# EasyEDA Pro project easyeda-2024-project.epro

# Schematic Schematic1
Create Date: 2024-07-01; Page Name: P1; Project Name: 风压式电脑散热器_2024-07-01_22-35-42; Schematic Name: Schematic1; Update Date: 2024-07-15; Company: 嘉立创EDA; Page Size: A4; Version: V1.0
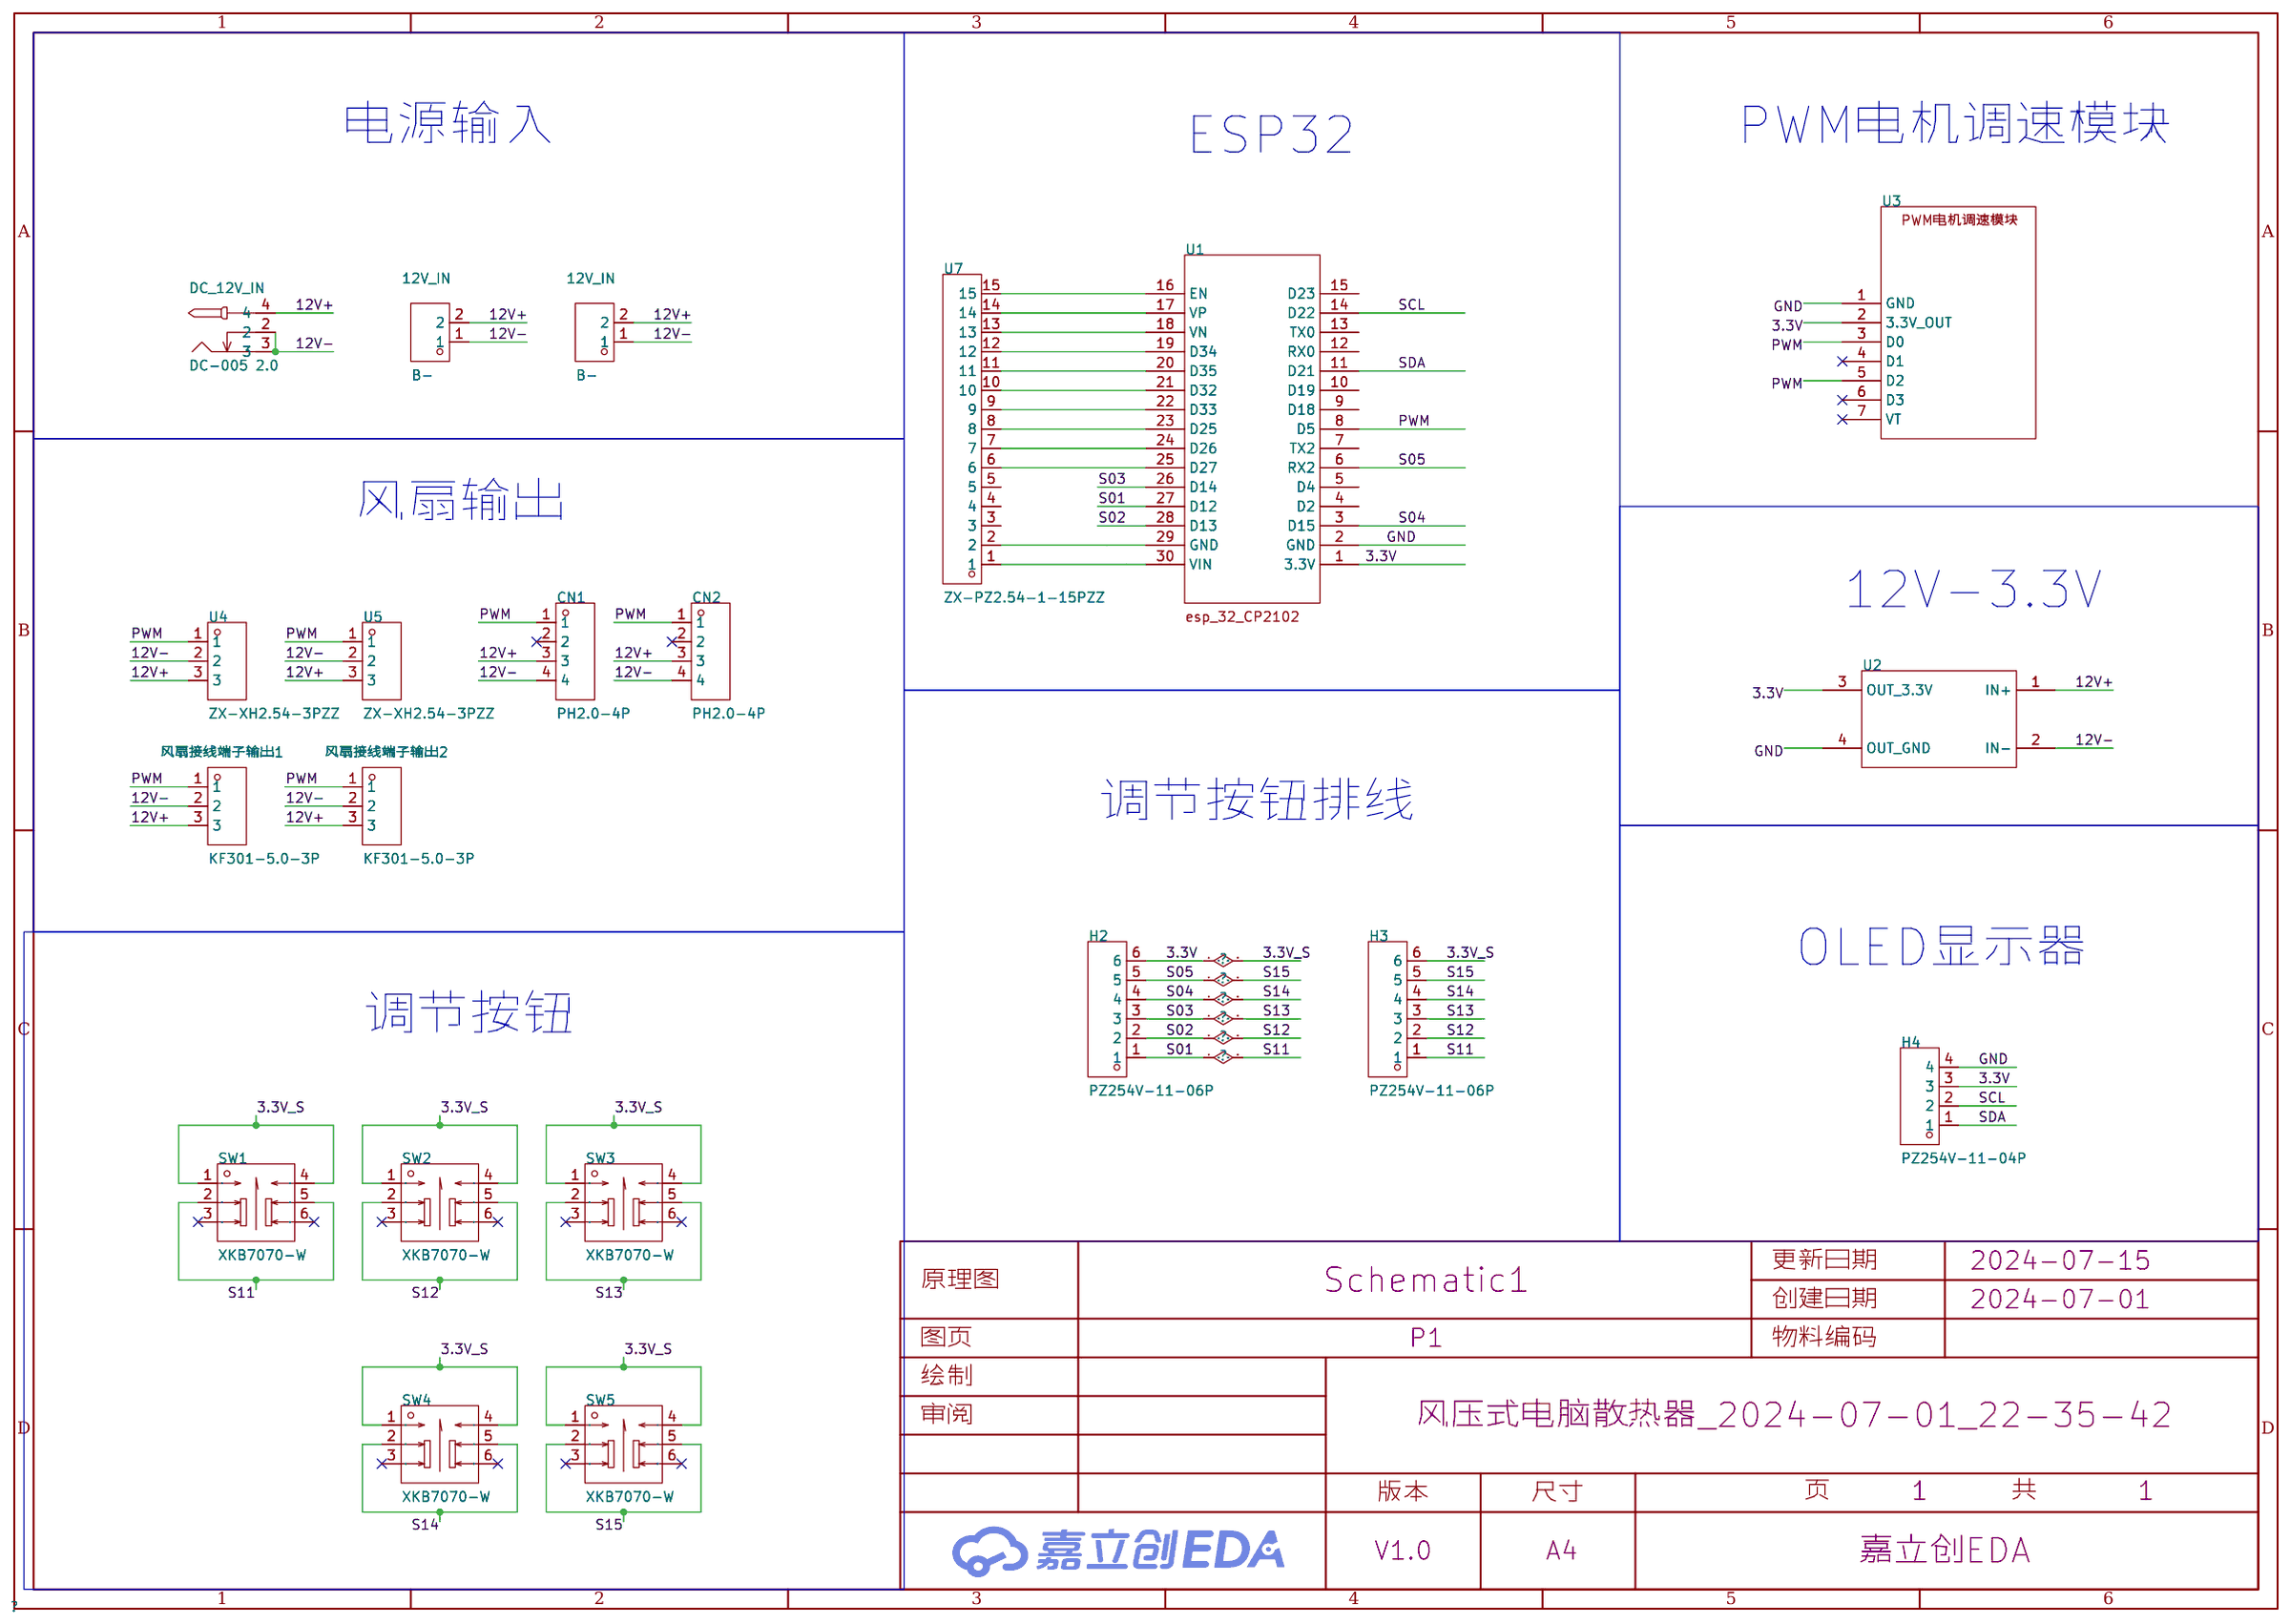
[diagram p0: schematic sheet]

## Parts
12V_IN  B-  [CONN-TH_P5.00_KF301-5.0-2P]
12V_IN#2  B-  [CONN-TH_P5.00_KF301-5.0-2P]
CN1  PH2.0-4P  [CONN-TH_PH2.0-4P]
CN2  PH2.0-4P  [CONN-TH_PH2.0-4P]
DC_12V_IN  DC-005 2.0  [DC-IN-TH_DC-5520-1]
H2  PZ254V-11-06P  [HDR-TH_6P-P2.54-V-M]
H3  PZ254V-11-06P  [HDR-TH_6P-P2.54-V-M]
H4  PZ254V-11-04P  [HDR-TH_4P-P2.54-V-M]
SW1  XKB7070-W  [SW-TH_6P-L7.2-W7.2-P2.00-LS5.0]
SW2  XKB7070-W  [SW-TH_6P-L7.2-W7.2-P2.00-LS5.0]
SW3  XKB7070-W  [SW-TH_6P-L7.2-W7.2-P2.00-LS5.0]
SW4  XKB7070-W  [SW-TH_6P-L7.2-W7.2-P2.00-LS5.0]
SW5  XKB7070-W  [SW-TH_6P-L7.2-W7.2-P2.00-LS5.0]
U1  -  [ESP32]
U2  -  [DC_3.3v]
U3  -  [PWM电机调速模块]
U4  ZX-XH2.54-3PZZ  [CONN-TH_3P-P2.54_2501S-3P]
U5  ZX-XH2.54-3PZZ  [CONN-TH_3P-P2.54_2501S-3P]
U7  ZX-PZ2.54-1-15PZZ  [HDR-TH_15P-P2.54-V-M]
风扇接线端子输出1  KF301-5.0-3P  [CONN-TH_3P-P5.00_KF301-5.0-3P]
风扇接线端子输出2  KF301-5.0-3P  [CONN-TH_3P-P5.00_KF301-5.0-3P]

## Library data of the parts
12V_IN 12V_IN#2 = KF301-5.0-2P: 间距:5mm;结构:1x2P;排数:1;每排PIN数:2;安装方式:直插;额定电流:17A;额定电压:250V;线规 - AWG:14~22;线规 - mm2:1.5;工作温度范围:-30℃~+120℃;颜色:蓝色;; LCSC Part Name: 5mm 1x2P 排数:1 每排P数:2 直插 可拼接 铜 环保; Supplier Part: C474881; Manufacturer: KEFA(科发); Supplier Footprint: 插件,P=5mm; JLCPCB Part Class: 扩展库; Datasheet: https://atta.szlcsc.com/upload/public/pdf/source/20230317/03A5B5FC229D6F9225E8F51DA1A4E80A.pdf; Supplier: LCSC; Pitch: 5mm; Structure: 1x2P; Number of Rows: 1; Number of PINs Per Row: 2; Mounting Style: 直插; Current Rating (Max): 17A; Voltage Rating (Max): 250V; Wire Gauge - AWG: 14~22; Wire Gauge - mm2: 1.5; Operating Temperature Range: -30℃~+120℃; Color: 蓝色; Number of Pins: 2P
CN1 CN2 = PH2.0-4P_C722763: 插针结构:1x4P;间距:2mm;安装方式:直插;参考系列:-;总PIN数:4P;排数:1;每排PIN数:4;行距:-;额定电流:5A;工作温度范围:-25℃~+85℃;; LCSC Part Name: 1x4P 间距:2mm 直插; Supplier Part: C722763; Manufacturer: CAX(创都); Supplier Footprint: 插件,P=2mm; JLCPCB Part Class: 扩展库; Datasheet: https://atta.szlcsc.com/upload/public/pdf/source/20200831/C722752_2CEED1D72592B01C53DF3269E60027F0.pdf; Supplier: LCSC; Pins Structure: 1x4P; Pitch: 2mm; Mounting Style: 直插; Number of Pins: 4P; Number of Rows: 1; Number of PINs Per Row: 4; Current Rating (Max): 5A; Operating Temperature Range: -25℃~+85℃
DC_12V_IN = DC-005 2.0: 连接器类型:DC电源插座;安装方式:弯插;触点内径:2mm;触点外径:6.4mm;额定电流:-;额定电压:-;工作温度范围:-;; LCSC Part Name: DC电源插座 内径:2mm 外径:6.4mm 铁材质; Supplier Part: C16214; Manufacturer: BOOMELE(博穆精密); Supplier Footprint: 插件; JLCPCB Part Class: 扩展库; Datasheet: https://atta.szlcsc.com/upload/public/pdf/source/20190827/C16214_DA59F99E888FED58D9833F5341D610B0.pdf; Supplier: LCSC; Connector Type: DC电源插座; Mounting Style: 弯插; Inside Contact Diameter: 2mm; Outside Contact Diameter: 6.4mm
H2 H3 = PZ254V-11-06P: 插针结构:1x6P;间距:2.54mm;行距:-;圆针/方针:方针;安装类型:直插;排数:单排;总PIN位数:6P;额定电流:-;额定电压:-;配合针长度:6mm;塑高:2.5mm;端接针长度:3mm;触头材质:黄铜;触头镀层:-;工作温度范围:-40℃~+105℃;颜色:黑色;; LCSC Part Name: 间距:2.54mm 1x6P 直插 方针; Supplier Part: C492405; Manufacturer: XFCN(兴飞); Supplier Footprint: 插件,P=2.54mm; JLCPCB Part Class: 扩展库; Datasheet: https://atta.szlcsc.com/upload/public/pdf/source/20200309/C492405_597F1930F5B55CC3C7FD95458F1C3977.pdf; Supplier: LCSC; Pin Structure: 1x6P; Pitch: 2.54mm; Circluar Pins/Square Pins: 方针; Mounting Type: 直插; Number of Rows: 单排; Number of Pins: 6P; Length of Mating Pin: 6mm; Insulation Height: 2.5mm; Length of End Connection Pin: 3mm; Contact Material: 黄铜; Operating Temperature Range: -40℃~+105℃; Color: 黑色
H4 = PZ254V-11-04P_C492403: 插针结构:1x4P;间距:2.54mm;行距:-;圆针/方针:方针;安装类型:直插;排数:单排;总PIN位数:4P;额定电流:-;额定电压:-;配合针长度:6mm;塑高:2.5mm;端接针长度:3mm;触头材质:黄铜;触头镀层:-;工作温度范围:-40℃~+105℃;颜色:黑色;; LCSC Part Name: 间距:2.54mm 1x4P 直插 方针; Supplier Part: C492403; Manufacturer: XFCN(兴飞); Supplier Footprint: 插件,P=2.54mm; JLCPCB Part Class: 扩展库; Datasheet: https://atta.szlcsc.com/upload/public/pdf/source/20200309/C492403_F9F19131791D08044AD4F84F8E751A34.pdf; Supplier: LCSC; Pin Structure: 1x4P; Pitch: 2.54mm; Circluar Pins/Square Pins: 方针; Mounting Type: 直插; Number of Rows: 单排; Number of Pins: 4P; Length of Mating Pin: 6mm; Insulation Height: 2.5mm; Length of End Connection Pin: 3mm; Contact Material: 黄铜; Operating Temperature Range: -40℃~+105℃; Color: 黑色
SW1-SW5 = XKB7070-W: 电路结构:-;自锁/无锁:无锁;安装方式:直插;触点电流:100mA;额定电压 (AC):250V;额定电压 (DC):30V;带灯:不带;作用力:160gf;机械寿命:1万次;; LCSC Part Name: 按键开关   7*7插件无锁 蓝白黑; Supplier Part: C318864; Manufacturer: XKB Connectivity(中国星坤); Supplier Footprint: 插件; JLCPCB Part Class: 扩展库; Datasheet: https://atta.szlcsc.com/upload/public/pdf/source/20211015/75A682A27A424BDE8D93C2CFA14C38FE.pdf; Supplier: LCSC; Self Lock / No Lock: 无锁; Actuator Style: 矩形按钮; Mounting Style: 直插; Contact Current: 100mA; Voltage Rating (AC): 250V; Voltage Rating (DC): 30V; Insulation Resistance: 100MΩ; Actuator/Cap Color: 蓝色; With Lamp: 不带; Pin Style: PC引脚; Operating Force: 160gf; Operating Temperature: -15℃~+55℃; Mechanical Life: 1万次
U1 = ESP-32
U2 = DC_3.3v
U3 = PWM电机调速模块
U4 U5 = ZX-XH2.54-3PZZ: 插针结构:1x3P;间距:2.54mm;安装方式:直插;参考系列:XH;总PIN数:3P;排数:1;每排PIN数:3;行距:-;额定电流:3A;触头材质:黄铜;触头镀层:锡;工作温度范围:-25℃~+85℃;; Supplier Part: C7429633; Manufacturer: Megastar(兆星); Supplier Footprint: 插件,P=2.54mm; JLCPCB Part Class: 扩展库; Datasheet: https://atta.szlcsc.com/upload/public/pdf/source/20230619/AE17037A2CFDBE8D9CBA775D61AD0A84.pdf; Supplier: LCSC; Pins Structure: 1x3P; Pitch: 2.54mm; Mounting Style: 直插; Reference Series: XH; Number of Pins: 3P; Number of Rows: 1; Number of PINs Per Row: 3; Current Rating (Max): 3A; Contact Material: 黄铜; Contact Plating: 锡; Operating Temperature Range: -25℃~+85℃
U7 = ZX-PZ2.54-1-15PZZ: 插针结构:1x15P;间距:2.54mm;行距:-;圆针/方针:方针;安装类型:直插;排数:单排;总PIN位数:15P;额定电流:3A;额定电压:1kV;配合针长度:6mm;塑高:2.5mm;端接针长度:3mm;触头材质:黄铜;触头镀层:金;工作温度范围:-40℃~+105℃;焊接温度(最大值):-;颜色:黑色;; LCSC Part Name: 1x15P 间距:2.54mm 方针 直插; Supplier Part: C7501269; Manufacturer: Megastar(兆星); Supplier Footprint: 插件,P=2.54mm; JLCPCB Part Class: Extended Part; Datasheet: https://atta.szlcsc.com/upload/public/pdf/source/20231122/A1A587BCB61FD4E661A7B23F28C6B7B8.pdf; Supplier: LCSC; Pin Structure: 1x15P; Pitch: 2.54mm; Circluar Pins/Square Pins: 方针; Mounting Type: 直插; Number of Rows: 单排; Number of Pins: 15P; Current Rating (Max): 3A; Voltage Rating (Max): 1kV; Length of Mating Pin: 6mm; Insulation Height: 2.5mm; Length of End Connection Pin: 3mm; Contact Material: 黄铜; Contact Plating: 金; Operating Temperature Range: -40℃~+105℃; Color: 黑色
风扇接线端子输出1 风扇接线端子输出2 = KF301-5.0-3P: 结构:1x3P;间距:5mm;颜色:蓝色;安装方式:直插;额定电流:17A;额定电压:250V;排数:1;线规 - AWG:14~22;线规 - 平方毫米:1.5;每排PIN数:3;工作温度范围:-30℃~+120℃;; LCSC Part Name: 5mm 1x3P 排数:1 每排P数:3 直插; Supplier Part: C474882; Manufacturer: KEFA(科发); Supplier Footprint: 插件,P=5mm; JLCPCB Part Class: 扩展库; Datasheet: https://atta.szlcsc.com/upload/public/pdf/source/20230317/03A5B5FC229D6F9225E8F51DA1A4E80A.pdf; Supplier: LCSC; Structure: 1x3P; Pitch: 5mm; Color: 蓝色; Mounting Style: 直插; Current Rating (Max): 17A; Voltage Rating (Max): 250V; Number of Pins: 3P; Number of Rows: 1; Wire Gauge - AWG: 14~22; Wire Gauge - mm2: 1.5; Number of PINs Per Row: 3; Operating Temperature Range: -30℃~+120℃

## Nets
3.3V: H2.6 H3.6 H4.3 SW1.1 SW1.4 SW2.1 SW2.4 SW3.1 SW3.4 SW4.1 SW4.4 SW5.1 SW5.4 U1.1(3.3V) U2.3(OUT_3.3V) U3.2(3.3V_OUT)
12V+: 12V_IN.2 12V_IN#2.2 CN1.3 CN2.3 DC_12V_IN.4 U2.1(IN+) U4.3 U5.3 风扇接线端子输出1.3 风扇接线端子输出2.3
12V-: 12V_IN.1 12V_IN#2.1 CN1.4 CN2.4 DC_12V_IN.2 DC_12V_IN.3 U2.2(IN-) U4.2 U5.2 风扇接线端子输出1.2 风扇接线端子输出2.2
GND: H4.4 U1.2(GND) U2.4(OUT_GND) U3.1(GND)
PWM: CN1.1 CN2.1 U1.8(D5) U3.3(D0) U3.5(D2) U4.1 U5.1 风扇接线端子输出1.1 风扇接线端子输出2.1
S01: H2.1 H3.1 SW1.2 SW1.5 U1.27(D12)
S02: H2.2 H3.2 SW2.2 SW2.5 U1.28(D13)
S03: H2.3 H3.3 SW3.2 SW3.5 U1.26(D14)
S04: H2.4 H3.4 SW4.2 SW4.5 U1.3(D15)
S05: H2.5 H3.5 SW5.2 SW5.5 U1.6(RX2)
SCL: H4.2 U1.14(D22)
SDA: H4.1 U1.11(D21)
$1N6643: U1.16(EN) U7.15
$1N6657: U1.17(VP) U7.14
$1N6660: U1.18(VN) U7.13
$1N6663: U1.19(D34) U7.12
$1N6666: U1.20(D35) U7.11
$1N6669: U1.21(D32) U7.10
$1N6672: U1.22(D33) U7.9
$1N6675: U1.23(D25) U7.8
$1N6678: U1.24(D26) U7.7
$1N6681: U1.25(D27) U7.6
$1N6684: U1.30(VIN) U7.1
$1N6687: U1.29(GND) U7.2

Not connected (* = marked no-connect by the designer): CN1 2*; CN2 2*; SW1 3* 6*; SW2 3* 6*; SW3 3* 6*; SW4 3* 6*; SW5 3* 6*; U1 4(D2) 5(D4) 7(TX2) 9(D18) 10(D19) 12(RX0) 13(TX0) 15(D23); U3 4(D1)* 6(D3)* 7(VT)*; U7 3 4 5

## Notes on the sheet
- 电源输入
- ESP32
- PWM电机调速模块
- 风扇输出
- 12V-3.3V
- 调节按钮排线
- OLED显示器
- 调节按钮

# Board PCB1
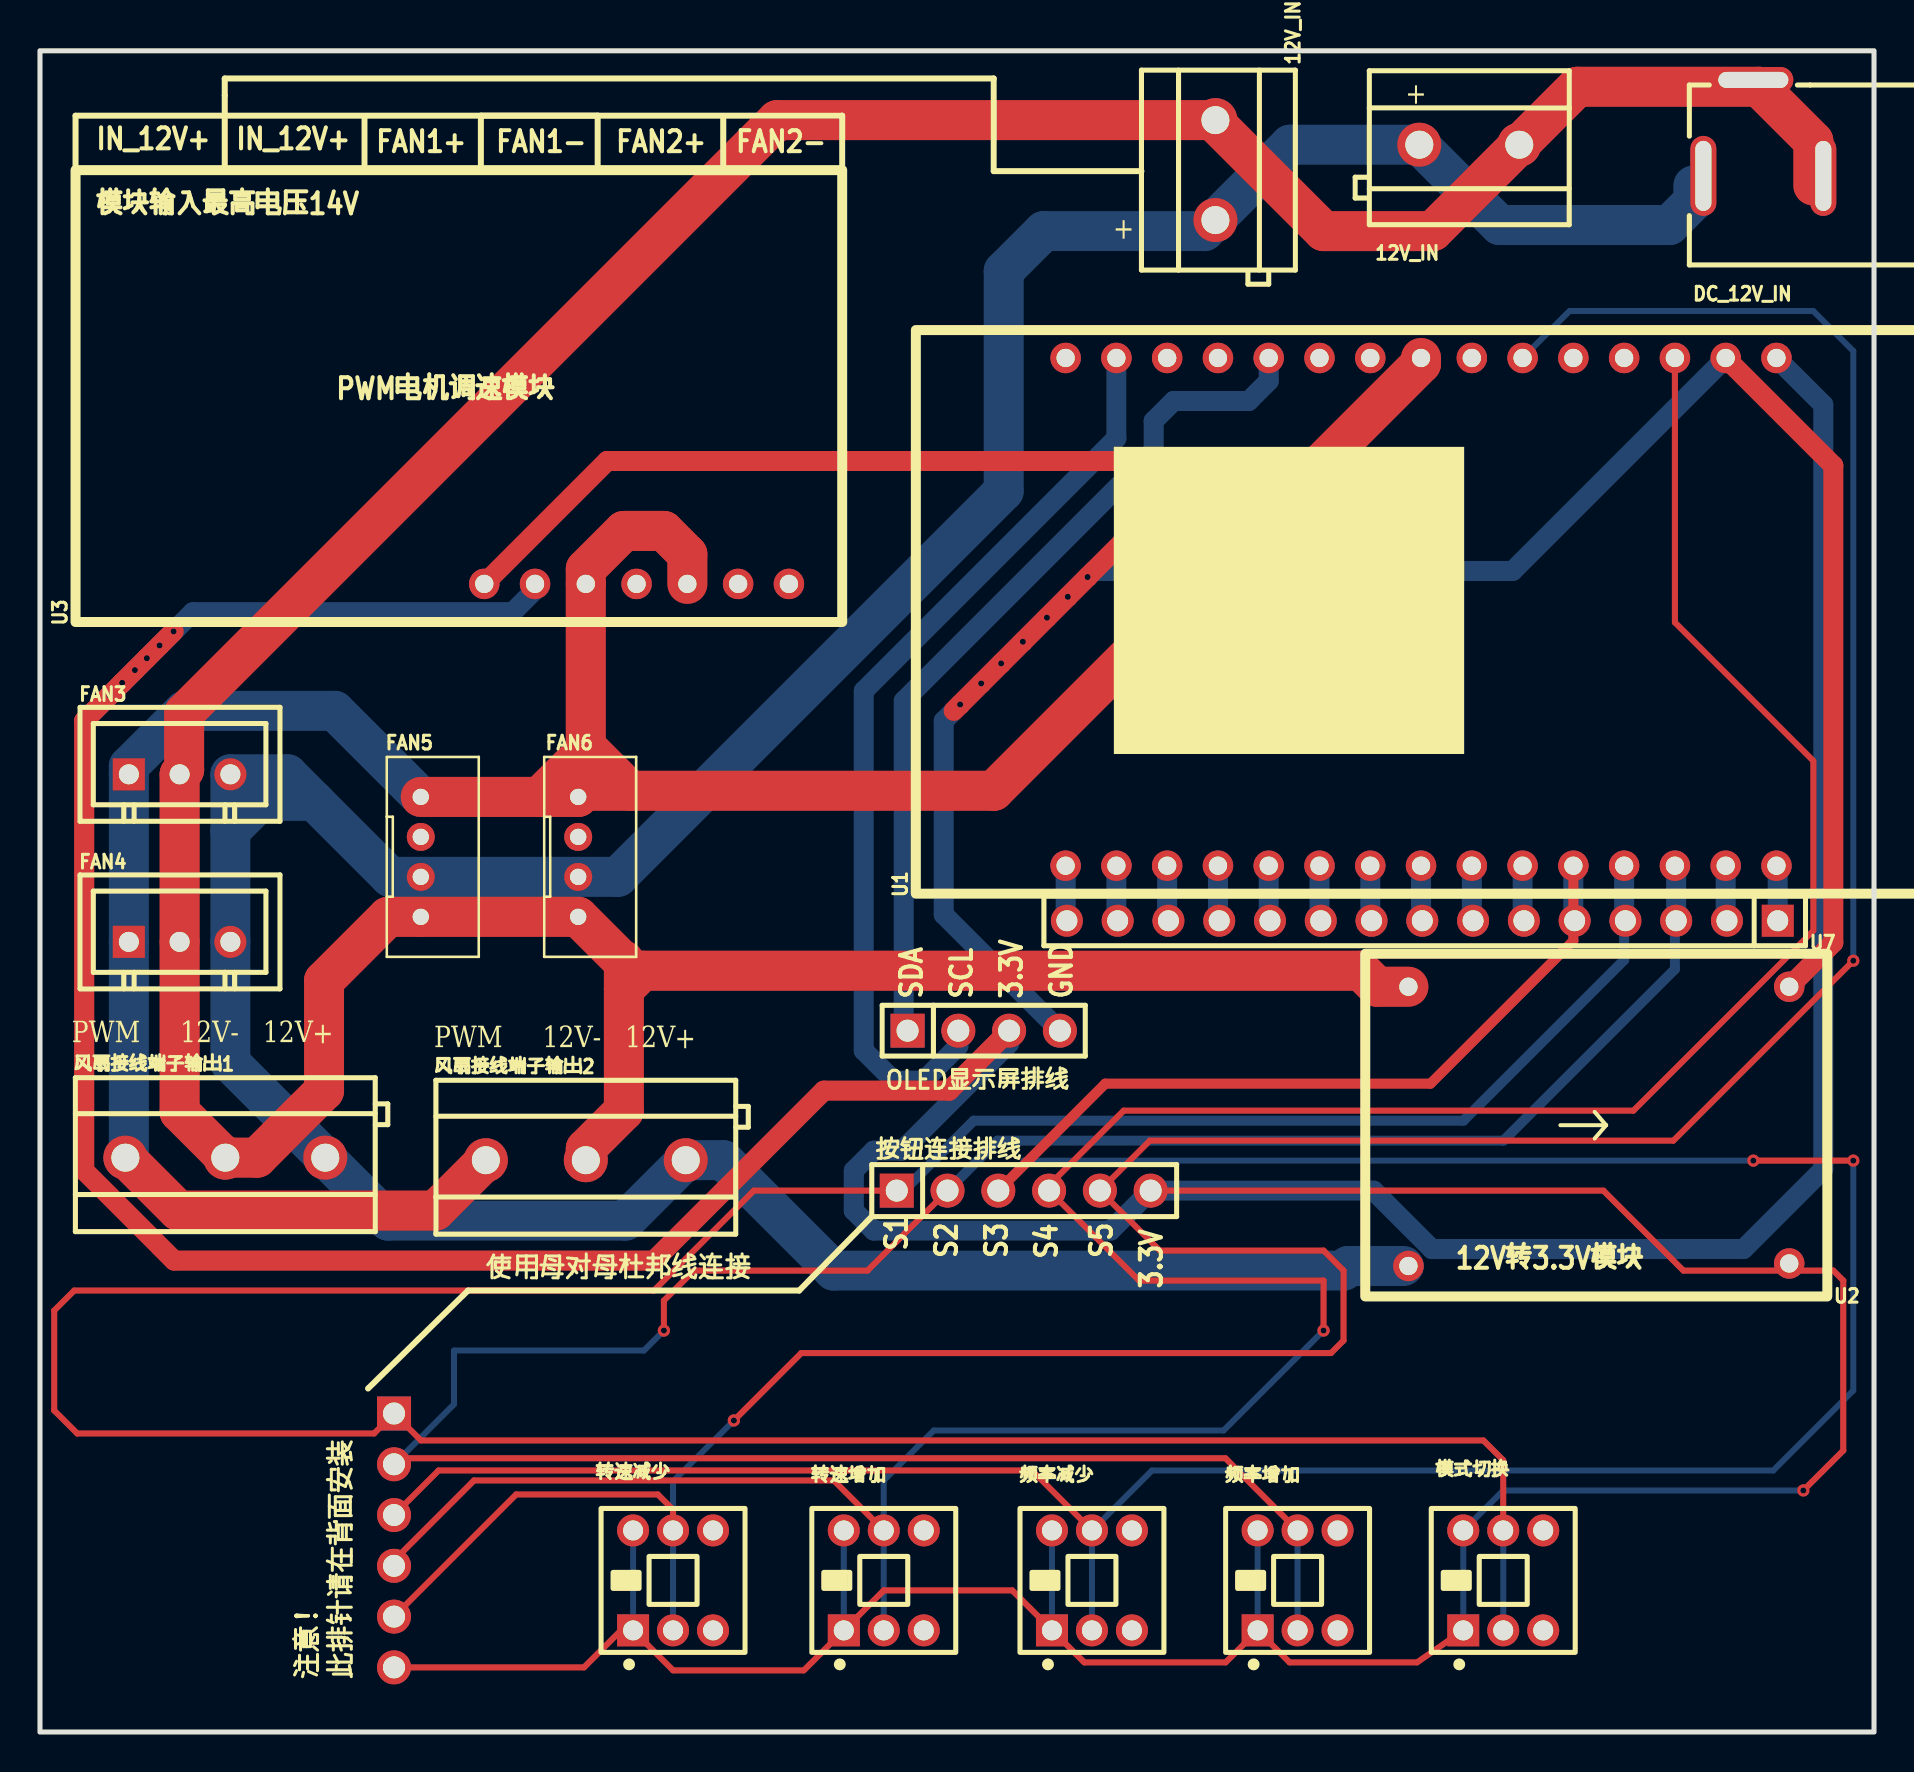
[diagram p1: board, top side]
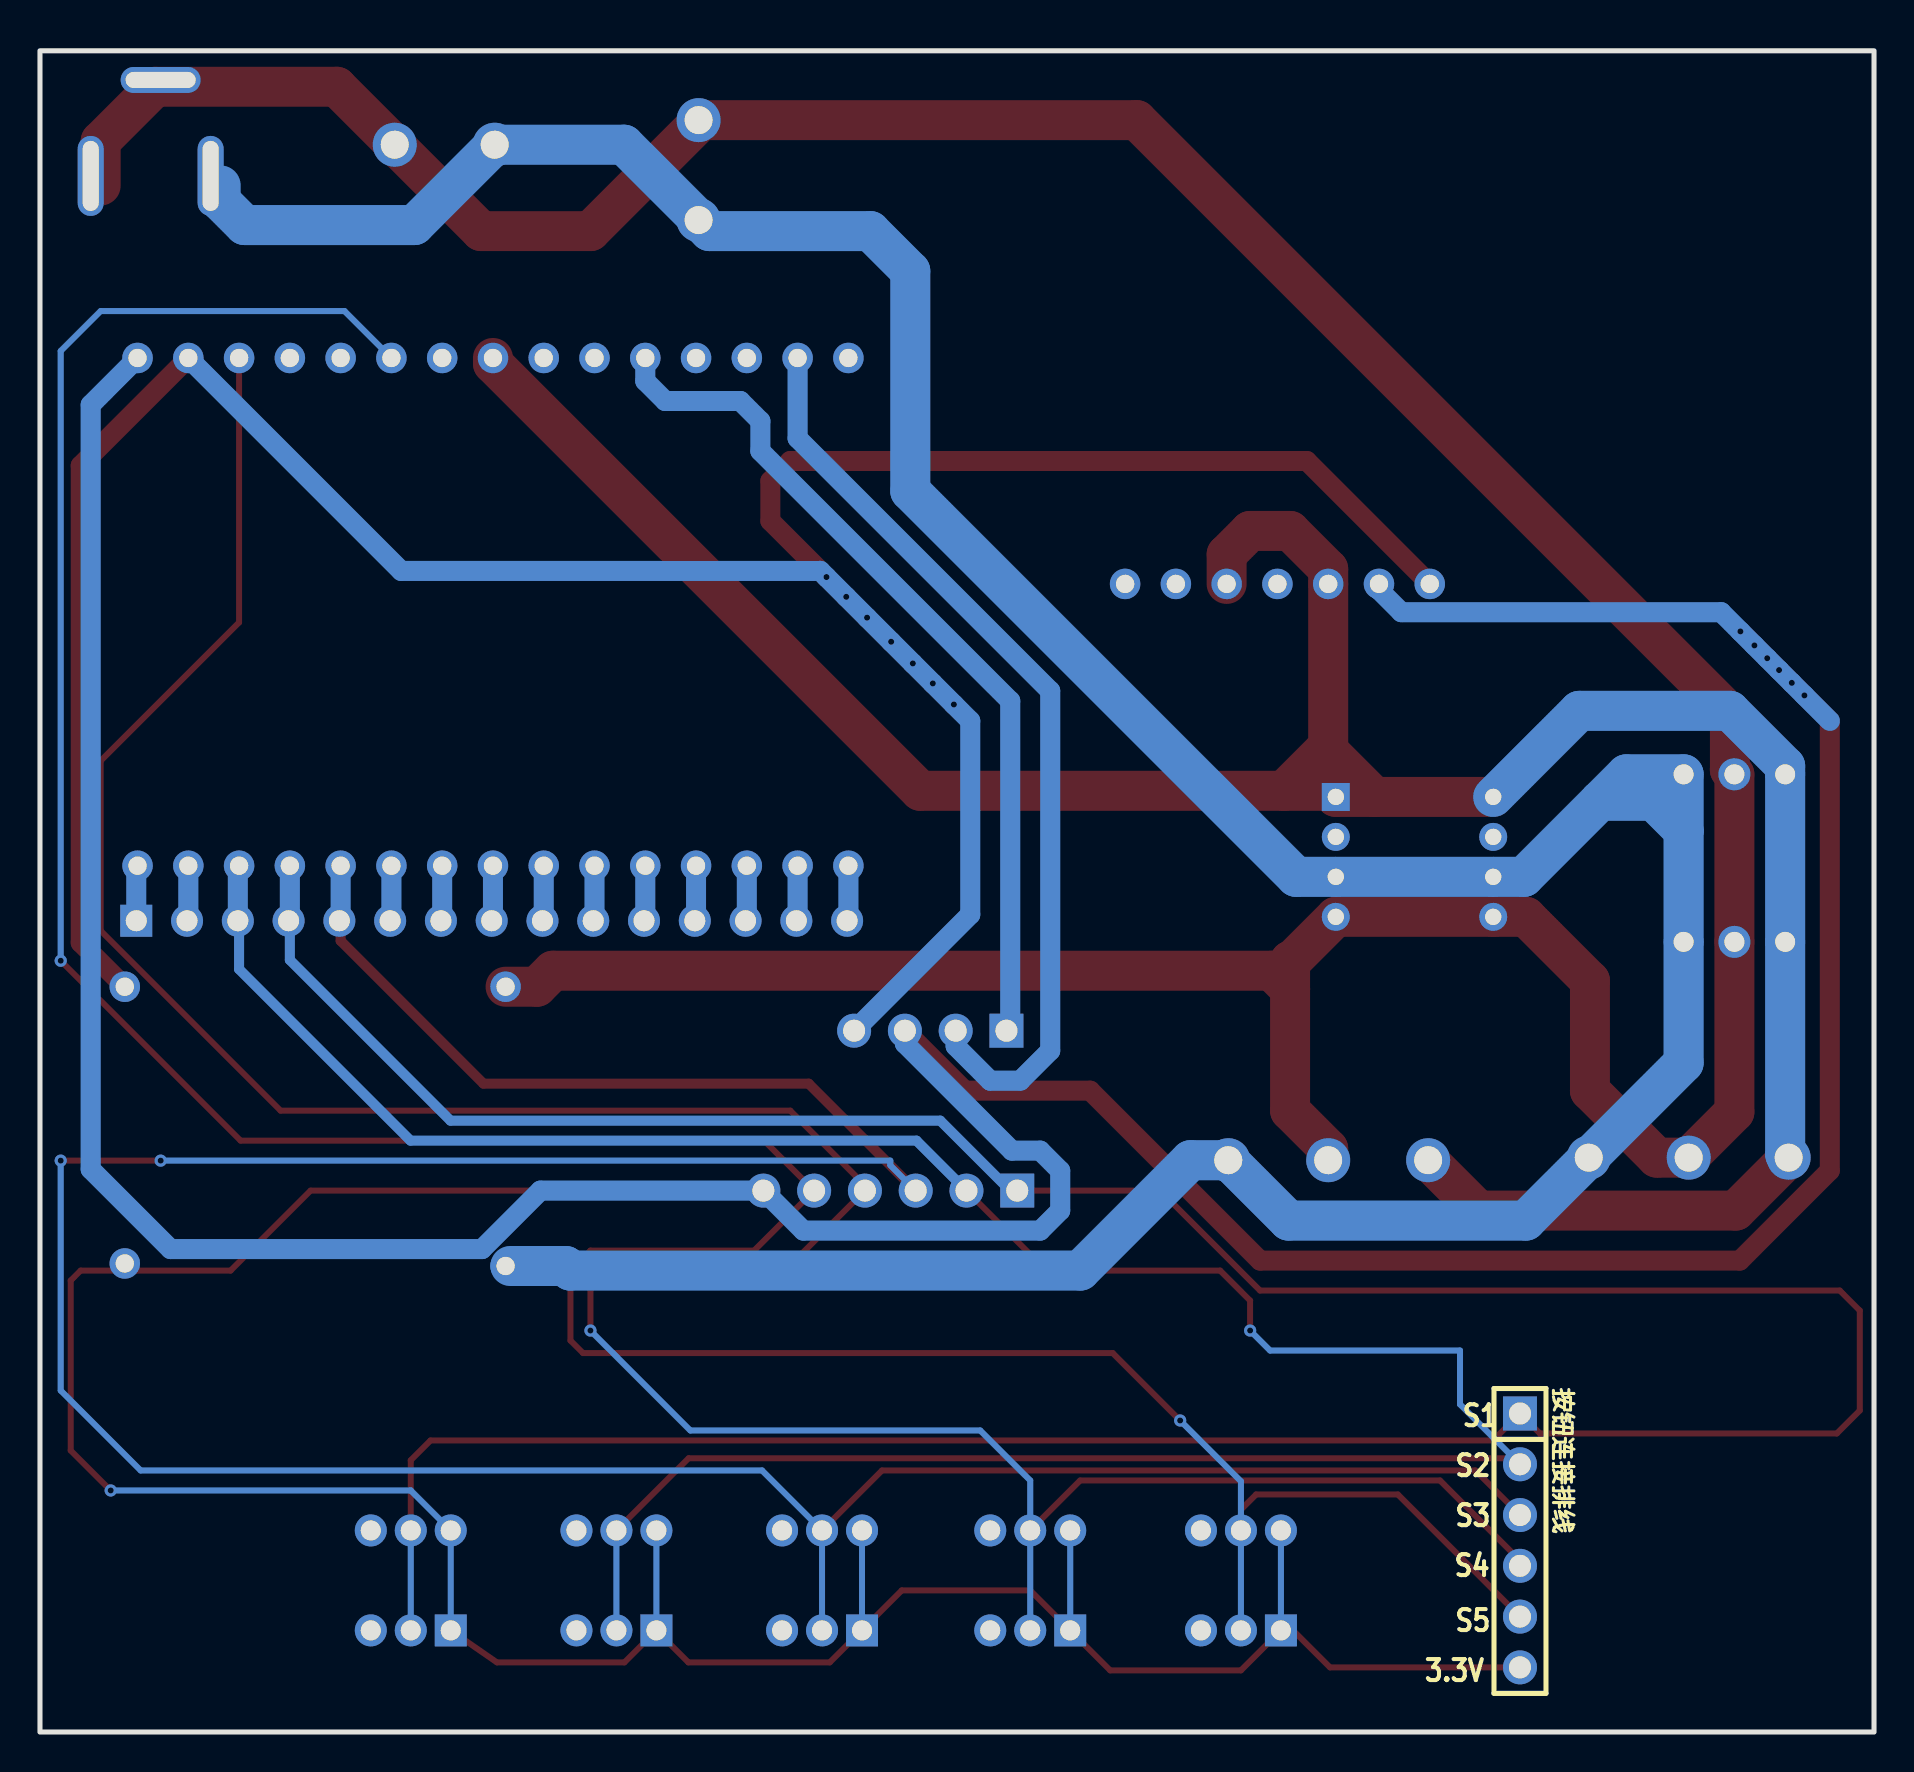
[diagram p2: board, bottom side, seen from below]

Outline 91.75 x 84.1 mm; copper layers: Top Layer, Bottom Layer. Coordinates in mm from the lower left corner of the outline.
Outline path: rectangle 0,84.1 91.75,0
Stack: Top Layer 0.035mm / Dielectric1 1.51mm FR4 er 4.5 / Bottom Layer 0.035mm

## Design rules (mm)
template: JLCPCB Capability(Two Layers Board)
spacing copperThickness1oz (default): track to track 0.102, other pairs 0.152 to 0.3
spacing copperThickness2oz: track to track 0.203, other pairs 0.152 to 0.3
track width copperThickness1oz (default): min 0.127, default 0.254, max 2.54
track width copperThickness2oz: min 0.203, default 0.254, max 2.54
differential pair differentialPair (default): width min 0.127, default 0.254, max 2.54; gap min 0.152, default 0.152
via viaSize (default): diameter min 0.5, default 0.61, max 10; hole min 0.3, default 0.305, max 6.3

## Placement (name value [footprint] x y rotation side)
12V_IN  B-  [CONN-TH_P5.00_KF301-5.0-2P]  58.8 78.14 270 top
12V_IN#2  B-  [CONN-TH_P5.00_KF301-5.0-2P]  71.5 79.41 180 top
DC_12V_IN  DC-005 2.0  [DC-IN-TH_DC-5520-1]  86.21 80.24 180 top
FAN3  ZX-XH2.54-3PZZ  [CONN-TH_3P-P2.54_2501S-3P]  6.98 47.91 0 top
FAN4  ZX-XH2.54-3PZZ  [CONN-TH_3P-P2.54_2501S-3P]  6.98 39.53 0 top
FAN5  PH2.0-4P  [CONN-TH_PH2.0-4P]  19.05 43.78 270 top
FAN6  PH2.0-4P  [CONN-TH_PH2.0-4P]  26.92 43.78 270 top
OLED显示屏排线  PZ254V-11-04P  [HDR-TH_4P-P2.54-V-M]  47.21 35.08 0 top
U1  -  [ESP32]  60.71 56.16 90 top
U2  -  [DC_3.3v]  76.71 32.58 180 top
U3  -  [PWM电机调速模块]  46.61 81.56 90 top
U7  ZX-PZ2.54-1-15PZZ  [HDR-TH_15P-P2.54-V-M]  69.15 40.58 180 top
按钮连接排线  -  [HDR-TH_6P-P2.54-V-M]  49.21 27.08 0 top
按钮连接排线#2  -  [HDR-TH_6P-P2.54-V-M]  17.71 9.58 270 bottom
模式切换  XKB7070-W  [SW-TH_6P-L7.2-W7.2-P2.00-LS5.0]  73.2 7.58 0 top
转速减少  XKB7070-W  [SW-TH_6P-L7.2-W7.2-P2.00-LS5.0]  31.67 7.58 0 top
转速增加  XKB7070-W  [SW-TH_6P-L7.2-W7.2-P2.00-LS5.0]  42.21 7.58 0 top
频率减少  XKB7070-W  [SW-TH_6P-L7.2-W7.2-P2.00-LS5.0]  52.62 7.58 0 top
频率增加  XKB7070-W  [SW-TH_6P-L7.2-W7.2-P2.00-LS5.0]  62.91 7.58 0 top
风扇接线端子输出1  KF301-5.0-3P  [CONN-TH_3P-P5.00_KF301-5.0-3P]  9.27 28.73 0 top
风扇接线端子输出2  KF301-5.0-3P  [CONN-TH_3P-P5.00_KF301-5.0-3P]  27.3 28.61 0 top

## Footprints (pads in the part's own frame, mm; a bottom-side part is the same pattern mirrored in y, then rotated)
CONN-TH_3P-P2.54_2501S-3P
  rect 1.6x1.6 hole 1: 1(-2.54,0)
  round 1.6 hole 1: 2(0,0) 3(2.54,0)
CONN-TH_3P-P5.00_KF301-5.0-3P
  round 2.2 hole 1.4: 1(-5,0) 2(0,0) 3(5,0)
CONN-TH_P5.00_KF301-5.0-2P
  round 2.2 hole 1.4: 1(-2.5,0) 2(2.5,0)
CONN-TH_PH2.0-4P
  rect 1.4x1.4 hole 0.813: 1(-3,0)
  round 1.4 hole 0.813: 2(-1,0) 3(1,0) 4(3,0)
DC-IN-TH_DC-5520-1
  oval 4x1.3 hole 3.5x0.8: 2(0.5,-2.4)
  oval 1.3x4 hole 0.8x3.5: 3(-3,2.4) 4(3,2.4)
DC_3.3v
  round 1.524 hole 0.914: 1(8.255,9.271) 2(8.255,-4.699) 3(-10.795,9.144) 4(-10.795,-4.699)
ESP32
  round 1.524 hole 0.914: 1(12.573,-26.162) 2(12.573,-23.622) 3(12.573,-21.082) 4(12.573,-18.542) 5(12.573,-16.002) 6(12.573,-13.462) 7(12.573,-10.922) 8(12.573,-8.382) 9(12.573,-5.842) 10(12.573,-3.302) 11(12.573,-0.762) 12(12.573,1.778) 13(12.573,4.318) 14(12.573,6.858) 15(12.573,9.398) 16(-12.827,9.398) 17(-12.827,6.858) 18(-12.827,4.318) 19(-12.827,1.778) 20(-12.827,-0.762) 21(-12.827,-3.302) 22(-12.827,-5.842) 23(-12.827,-8.382) 24(-12.827,-10.922) 25(-12.827,-13.462) 26(-12.827,-16.002) 27(-12.827,-18.542) 28(-12.827,-21.082) 29(-12.827,-23.622) 30(-12.827,-26.162)
HDR-TH_4P-P2.54-V-M
  rect 1.7x1.7 hole 1.1: 1(-3.81,0)
  round 1.7 hole 1.1: 2(-1.27,0) 3(1.27,0) 4(3.81,0)
HDR-TH_6P-P2.54-V-M
  rect 1.7x1.7 hole 1.1: 1(-6.35,0)
  round 1.7 hole 1.1: 2(-3.81,0) 3(-1.27,0) 4(1.27,0) 5(3.81,0) 6(6.35,0)
HDR-TH_15P-P2.54-V-M
  rect 1.6x1.6 hole 1.05: 1(-17.78,0)
  round 1.6 hole 1.05: 2(-15.24,0) 3(-12.7,0) 4(-10.16,0) 5(-7.62,0) 6(-5.08,0) 7(-2.54,0) 8(0,0) 9(2.54,0) 10(5.08,0) 11(7.62,0) 12(10.16,0) 13(12.7,0) 14(15.24,0) 15(17.78,0)
PWM电机调速模块
  round 1.524 hole 0.914: 1(-24.13,24.384) 2(-24.13,21.844) 3(-24.13,19.304) 4(-24.13,16.764) 5(-24.13,14.224) 6(-24.13,11.684) 7(-24.13,9.144)
SW-TH_6P-L7.2-W7.2-P2.00-LS5.0
  rect 1.6x1.6 hole 1: 1(-2,-2.5)
  round 1.6 hole 1: 2(0,-2.5) 3(2,-2.5) 4(-2,2.499) 5(0,2.5) 6(2,2.5)

## Nets
3.3V: OLED显示屏排线.3 U1.1 U2.3 U3.2 按钮连接排线.6 按钮连接排线#2.6 模式切换.1 模式切换.4 转速减少.1 转速减少.4 转速增加.1 转速增加.4 频率减少.1 频率减少.4 频率增加.1 频率增加.4
12V+: 12V_IN.2 12V_IN#2.2 DC_12V_IN.4 FAN3.3 FAN4.3 FAN5.3 FAN6.3 U2.1 风扇接线端子输出1.3 风扇接线端子输出2.3
12V-: 12V_IN.1 12V_IN#2.1 DC_12V_IN.2 DC_12V_IN.3 FAN3.2 FAN4.2 FAN5.4 FAN6.4 U2.2 风扇接线端子输出1.2 风扇接线端子输出2.2
GND: OLED显示屏排线.4 U1.2 U2.4 U3.1
PWM: FAN3.1 FAN4.1 FAN5.1 FAN6.1 U1.8 U3.3 U3.5 风扇接线端子输出1.1 风扇接线端子输出2.1
S01: U1.27 U7.4 按钮连接排线.1 按钮连接排线#2.1 模式切换.2 模式切换.5
S02: U1.28 U7.3 按钮连接排线.2 按钮连接排线#2.2 频率增加.2 频率增加.5
S03: U1.26 U7.5 按钮连接排线.3 按钮连接排线#2.3 频率减少.2 频率减少.5
S04: U1.3 按钮连接排线.4 按钮连接排线#2.4 转速增加.2 转速增加.5
S05: U1.6 按钮连接排线.5 按钮连接排线#2.5 转速减少.2 转速减少.5
SCL: OLED显示屏排线.2 U1.14
SDA: OLED显示屏排线.1 U1.11
$1N6643: U1.16 U7.15
$1N6657: U1.17 U7.14
$1N6660: U1.18 U7.13
$1N6663: U1.19 U7.12
$1N6666: U1.20 U7.11
$1N6669: U1.21 U7.10
$1N6672: U1.22 U7.9
$1N6675: U1.23 U7.8
$1N6678: U1.24 U7.7
$1N6681: U1.25 U7.6
$1N6684: U1.30 U7.1
$1N6687: U1.29 U7.2

Pads without a net: FAN5 2; FAN6 2; U1 4 5 7 9 10 12 13 15; U3 4 6 7; 模式切换 3 6; 转速减少 3 6; 转速增加 3 6; 频率减少 3 6; 频率增加 3 6

## Via types
v1: diameter 0.61, hole 0.305, Top Layer to Bottom Layer, 20 vias

## Routing (per net, layer and track width the routed paths; a pad name or vN(x,y) marks a point on that pad's centre or on a via; arc(x,y) is an arc through that point)
3.3V: length 289.7
  Top Layer w0.3: 按钮连接排线#2.6 27.21,3.23 ; 按钮连接排线.6 78.21,27.08 82.21,23.08 89.71,23.08 90.21,22.58 90.21,14.08 v1(88.21,12.08)
  Top Layer w1: v1(6.68,55.06) v1(5.98,54.36) v1(5.34,53.72) v1(4.75,53.12) v1(4.11,52.48) v1(3.48,51.85) 2.21,50.58 2.21,28.08 6.71,23.58 30.71,23.58 39.21,32.08 45.48,32.08 OLED显示屏排线.3
  Bottom Layer w0.3: 模式切换.4 73.2,12.08 v1(88.21,12.08)
  Bottom Layer w1: U3.2 24.77,57.14 23.65,56.02 7.65,56.02 v1(6.68,55.06) v1(5.98,54.36) v1(5.34,53.72) v1(4.75,53.12) v1(4.11,52.48) v1(3.48,51.85) 2.21,50.58 ; OLED显示屏排线.3 48.48,34.44 43.12,29.08 41.71,29.08 40.71,28.08 40.71,26.08 41.71,25.08 53.56,25.08 按钮连接排线.6 66.71,27.08 69.64,24.16 85.22,24.16 89.21,28.15 89.21,66.39 U1.1
12V+: length 184.7
  Bottom Layer w2: 13.71,46.58 17.52,42.78 FAN5.3 FAN6.3 28.91,42.78 48.21,62.08 48.21,73.08 50.21,75.08 58.25,75.08 12V_IN.2 58.8,75.67 62.53,79.41 12V_IN#2.2 73.02,75.39 81.51,75.39 82.71,76.58 82.71,77.36 ; 13.71,46.58 12.39,47.91 FAN3.3 9.52,45.08 ; 13.71,46.58 11.02,46.58 9.52,45.08 ; 9.52,45.08 FAN4.3 9.52,33.48 风扇接线端子输出1.3 17.42,25.58 29.28,25.58 风扇接线端子输出2.3 34.19,28.61 39.71,23.08 65.22,23.08 65.45,23.31 68.22,23.31
12V-: length 205.6
  Top Layer w2: 29.21,37.16 29.21,31.08 27.3,29.18 风扇接线端子输出2.2 ; 29.21,37.16 30.14,38.08 66.09,38.08 66.89,37.28 U2.2 ; 29.21,37.16 29.21,38.58 29.12,38.58 FAN6.4 FAN5.4 17.41,40.78 14.21,37.58 14.21,32.08 10.86,28.73 风扇接线端子输出1.2 6.98,31.02 FAN4.2 FAN3.2 7.21,48.14 7.21,50.96 36.88,80.64 12V_IN.1 58.8,80.49 64.21,75.08 69.68,75.08 12V_IN#2.1 76.9,82.3 85.99,82.3 88.71,79.58 88.71,77.36
GND: length 150.5
  Top Layer w1: 84.33,68.74 89.71,63.35 89.71,39.49 U2.4 ; 45.71,51.08 v1(46.03,51.4) v1(47.08,52.46) v1(48.08,53.46) v1(49.17,54.54) v1(50.37,55.75) v1(51.42,56.79) v1(52.4,57.78) 55.21,60.58 55.21,62.58 54.21,63.58 28.37,63.58 U3.1
  Bottom Layer w1: 84.33,68.74 73.67,58.08 52.71,58.08 v1(52.4,57.78) v1(51.42,56.79) v1(50.37,55.75) v1(49.17,54.54) v1(48.08,53.46) v1(47.08,52.46) v1(46.03,51.4) 45.21,50.58 45.21,40.89 OLED显示屏排线.4
PWM: length 141.9
  Top Layer w2: 29.52,47.08 27.52,49.08 27.3,49.08 ; 29.52,47.08 27.23,47.08 ; 29.52,47.08 47.71,47.08 69.09,68.46 U1.8 ; 27.3,49.08 27.3,47.16 27.23,47.08 ; 27.3,49.08 U3.3 27.3,58.18 29.21,60.08 31.21,60.08 32.39,58.91 U3.5 ; 27.3,49.08 27.29,49.08 24.99,46.78 ; 27.23,47.08 FAN6.1 24.99,46.78 ; 24.99,46.78 FAN5.1 ; 风扇接线端子输出1.1 6.92,26.08 19.78,26.08 风扇接线端子输出2.1
  Bottom Layer w2: 风扇接线端子输出1.1 4.44,28.91 FAN4.1 FAN3.1 4.44,48.32 7.21,51.08 14.74,51.08 FAN5.1
S01: length 178.5
  Top Layer w0.3: 按钮连接排线.1 35.71,27.08 30.71,22.08 1.71,22.08 0.71,21.08 0.71,16.08 1.86,14.93 16.71,14.93 按钮连接排线#2.1 19.06,14.58 72.21,14.58 73.2,13.6 模式切换.5
  Bottom Layer w0.3: 模式切换.5 模式切换.2
  Bottom Layer w0.5: 79.25,40.65 79.25,38.62 71.21,30.58 46.71,30.58 43.21,27.08 按钮连接排线.1
  Bottom Layer w1: U7.4 79.25,40.65 U1.27
S02: length 136.6
  Top Layer w0.3: 按钮连接排线#2.2 18.01,13.69 59.3,13.69 频率增加.5 ; 按钮连接排线.2 41.4,23.08 32.71,23.08 31.21,21.58 v1(31.21,20.08)
  Bottom Layer w0.3: 按钮连接排线#2.2 20.71,16.39 20.71,19.08 30.21,19.08 v1(31.21,20.08) ; 频率增加.5 频率增加.2
  Bottom Layer w0.5: 按钮连接排线.2 47.9,29.58 73.21,29.58 81.79,38.16 U1.28
  Bottom Layer w1: U7.3 81.85,43.27 U1.28
S03: length 178.1
  Top Layer w0.3: 频率减少.5 49.62,13.08 19.94,13.08 按钮连接排线#2.3 ; v1(85.71,28.58) v1(90.71,28.58)
  Top Layer w0.5: U1.26 76.71,39.58 69.56,32.43 53.29,32.43 按钮连接排线.3
  Bottom Layer w0.3: v1(90.71,28.58) 90.71,17.08 86.71,13.08 55.62,13.08 52.94,10.4 ; 频率减少.5 频率减少.2 ; v1(85.71,28.58) 49.21,28.58 49.21,28.35 按钮连接排线.3
  Bottom Layer w1: U7.5 76.71,40.65 U1.26
S04: length 153
  Top Layer w0.3: 转速增加.5 39.71,12.58 21.71,12.58 17.71,8.58 按钮连接排线#2.4 ; U1.3 81.79,55.51 88.71,48.58 88.71,40.08 79.71,31.08 54.21,31.08 50.48,27.35 按钮连接排线.4 54.98,22.58 64.21,22.58 v1(64.21,20.08)
  Bottom Layer w0.3: v1(64.21,20.08) 59.21,15.08 44.71,15.08 42.21,12.58 42.21,10.54 ; 转速增加.5 转速增加.2
S05: length 170
  Top Layer w0.3: 转速减少.5 31.67,11.12 30.91,11.88 23.82,11.88 按钮连接排线#2.5 ; v1(90.71,38.58) 81.71,29.58 55.52,29.58 按钮连接排线.5 56.02,24.08 64.21,24.08 65.21,23.08 65.21,19.58 64.58,18.96 38.08,18.96 v1(34.71,15.58)
  Bottom Layer w0.3: v1(34.71,15.58) 31.67,12.54 31.67,10.54 ; U1.6 76.52,71.08 88.71,71.08 90.71,69.08 v1(90.71,38.58) ; 转速减少.5 转速减少.2
SCL: length 46.7
  Bottom Layer w1: U1.14 53.85,64.72 41.21,52.08 41.21,34.08 42.71,32.58 44.21,32.58 45.94,34.31 OLED显示屏排线.2
SDA: length 43.5
  Bottom Layer w1: OLED显示屏排线.1 43.21,35.27 43.21,51.58 55.71,64.08 55.71,65.58 56.71,66.58 60.47,66.58 61.47,67.58 U1.11
$1N6643: length 2.8
  Bottom Layer w1: U7.15 51.31,40.65 U1.16
$1N6657: length 2.8
  Bottom Layer w1: U7.14 53.85,40.65 U1.17
$1N6660: length 2.8
  Bottom Layer w1: U1.18 56.39,40.65 U7.13
$1N6663: length 2.8
  Bottom Layer w1: U7.12 58.93,40.65 U1.19
$1N6666: length 2.8
  Bottom Layer w1: U7.11 61.47,40.65 U1.20
$1N6669: length 2.8
  Bottom Layer w1: U1.21 64.01,40.65 U7.10
$1N6672: length 2.8
  Bottom Layer w1: U7.9 66.55,40.65 66.55,43.34
$1N6675: length 2.8
  Bottom Layer w1: U1.23 69.09,40.65 U7.8
$1N6678: length 2.8
  Bottom Layer w1: U1.24 71.63,40.65 U7.7
$1N6681: length 2.8
  Bottom Layer w1: U1.25 74.17,40.65 U7.6
$1N6684: length 2.8
  Bottom Layer w1: U7.1 86.93,43.27 U1.30
$1N6687: length 2.8
  Bottom Layer w1: 84.33,43.34 84.33,40.65 U7.2

## Copper pours and planes (outline as drawn; the poured copper is in the pictures)
12V+ on Bottom Layer: 68.21,23.58 66.71,25.08 55.21,25.08 54.21,24.08 41.21,24.08 39.21,26.08 39.21,52.08 48.71,61.58 49.21,61.58 49.21,74.58 92.71,74.58 92.71,86.27 47.9,86.27 36.21,74.58 36.21,59.08 19.91,42.78 18,42.78 17.65,42.42 12.99,47.08 12.21,47.08 10.49,45.36 9.52,45.36 9.52,33.48 17.71,25.29 17.71,25.08 20.71,22.08 67.21,22.08 68.21,23.08
12V- on Top Layer: 92.71,86.08 33.21,86.08 8.71,61.58 8.71,54.08 6.21,51.58 6.21,29.58 7.71,28.08 18.71,28.08 21.71,31.08 23.21,31.08 24.71,29.58 24.71,27.08 28.78,27.08 37.78,36.08 68.69,36.08 69.32,37.28 66.71,39.58 49.21,39.58 47.02,41.78 17.71,41.78 17.71,54.58 33.21,70.08 92.71,70.08

## Text on the board
Bottom Silkscreen Layer: S1 | S2 | S3 | S5 | S4 | 3.3V
Top Silkscreen Layer: IN_12V+ | FAN1+ | FAN1- | FAN2+ | FAN2- | S1 | SDA | S2 | SCL | S3 | 3.3V | S4 | GND | S5 | PWM     12V-   12V+ | 使用母对母杜邦线连接 | 注意！ / 此排针请在背面安装 | 模块输入最高电压14V | PWM电机调速模块 | + | 12V转3.3V模块 | →
